# EAGLE schematic BlueESC (EAGLE 7.1.0)
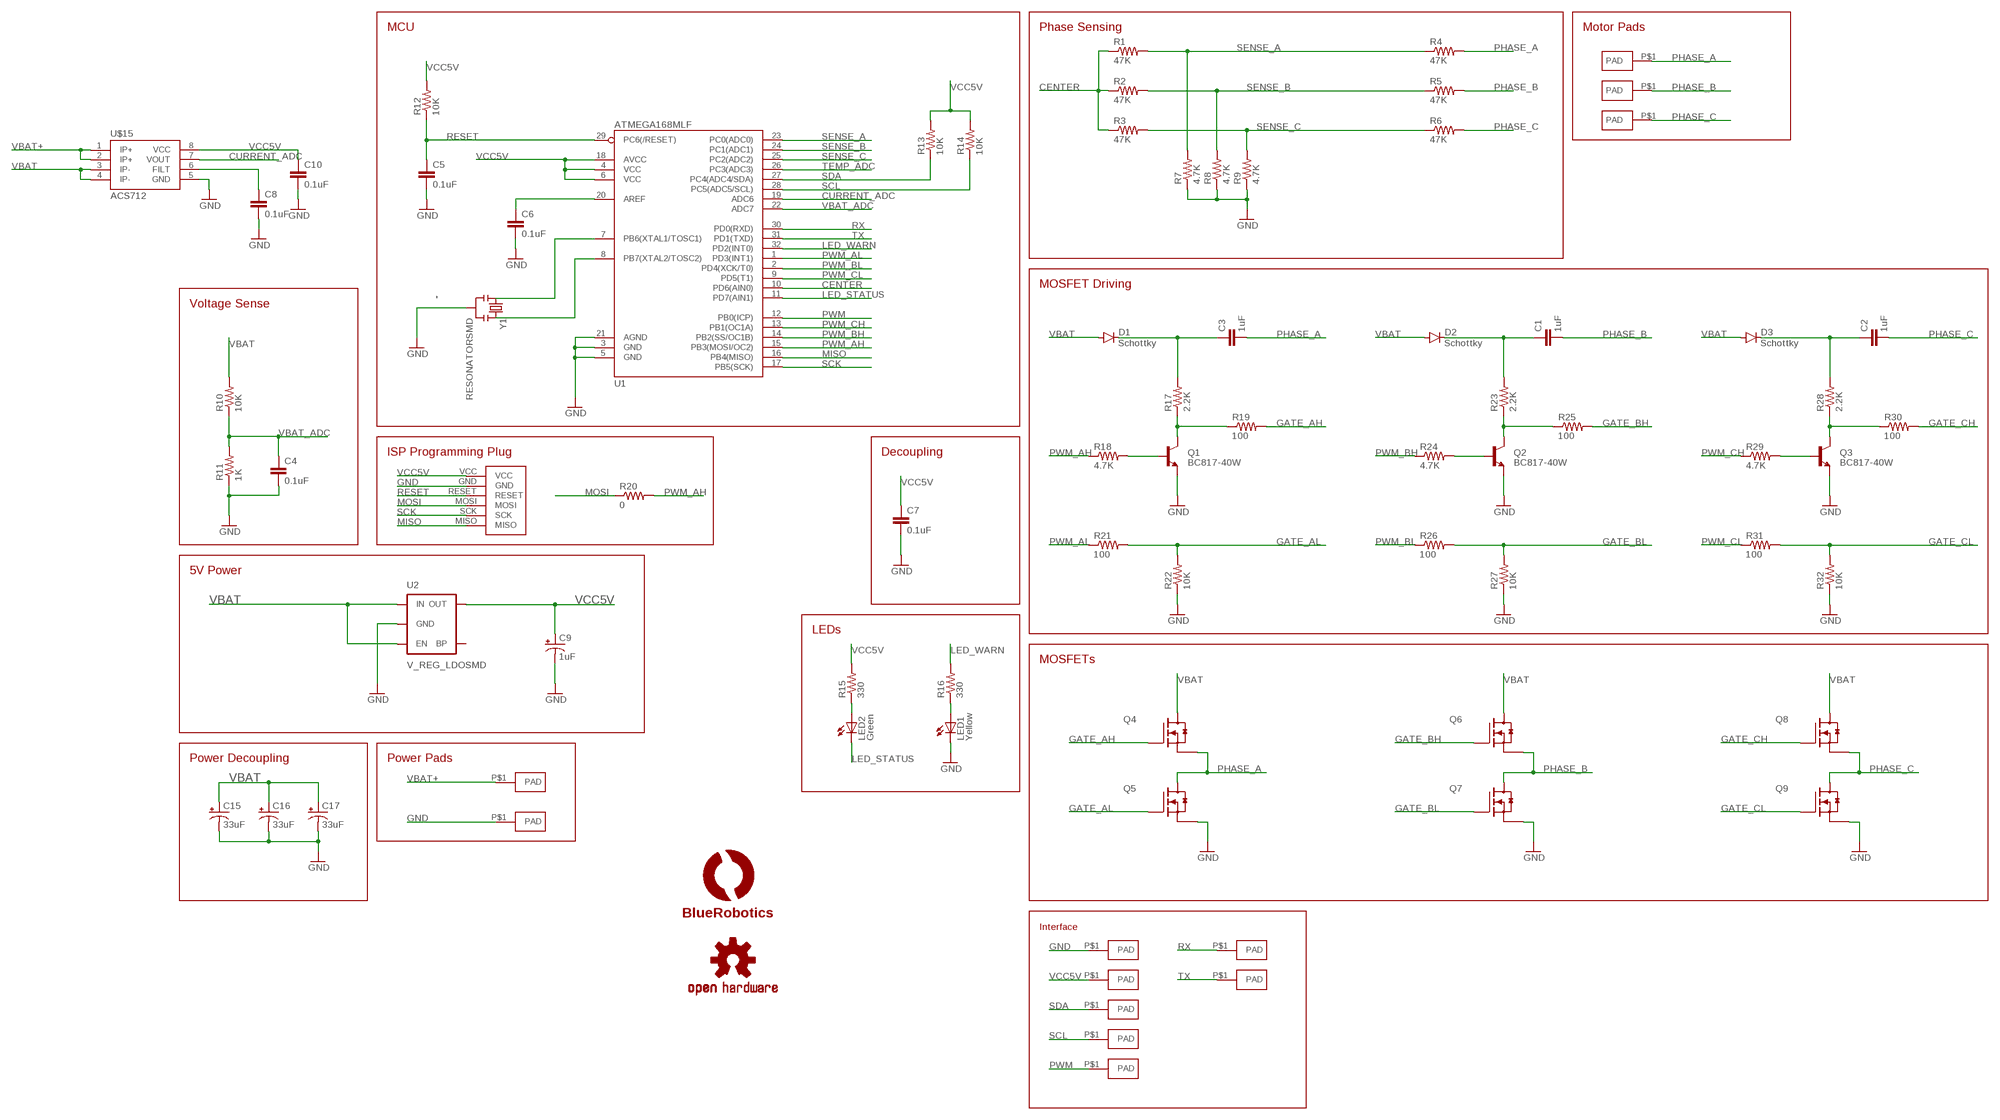
[diagram p0: schematic, sheet 1]

## Parts
C1  1uF  CAP0805  [0805]
C2  1uF  CAP0805  [0805]
C3  1uF  CAP0805  [0805]
C4  0.1uF  CAP0603-CAP  [0603-CAP]
C5  0.1uF  CAP0603-CAP  [0603-CAP]
C6  0.1uF  CAP0603-CAP  [0603-CAP]
C7  0.1uF  CAP0603-CAP  [0603-CAP]
C8  0.1uF  CAP0603-CAP  [0603-CAP]
C9  1uF  CAP_POL1206  [EIA3216]
C10  0.1uF  CAP0603-CAP  [0603-CAP]
C15  33uF  CAP_POL6032  [EIA6032]
C16  33uF  CAP_POL6032  [EIA6032]
C17  33uF  CAP_POL6032  [EIA6032]
D1  Schottky  DIODESOD  [SOD-323]
D2  Schottky  DIODESOD  [SOD-323]
D3  Schottky  DIODESOD  [SOD-323]
LED1  Yellow  LED-3MM-NO_SILK  [LED3MM-NS]
LED2  Green  LED-3MM-NO_SILK  [LED3MM-NS]
LOGO1  OSHW-LOGOS  [OSHW-LOGO-S]
Q1  BC817-40W  TRANSISTOR_NPNSOT23  [SOT23]
Q2  BC817-40W  TRANSISTOR_NPNSOT23  [SOT23]
Q3  BC817-40W  TRANSISTOR_NPNSOT23  [SOT23]
Q4  SI7370  [POWERPAK-SO-08]
Q5  SI7370  [POWERPAK-SO-08]
Q6  SI7370  [POWERPAK-SO-08]
Q7  SI7370  [POWERPAK-SO-08]
Q8  SI7370  [POWERPAK-SO-08]
Q9  SI7370  [POWERPAK-SO-08]
R1  47K  33KOHM1/10W1%(0603)  [0603-RES]
R2  47K  33KOHM1/10W1%(0603)  [0603-RES]
R3  47K  33KOHM1/10W1%(0603)  [0603-RES]
R4  47K  33KOHM1/10W1%(0603)  [0603-RES]
R5  47K  33KOHM1/10W1%(0603)  [0603-RES]
R6  47K  33KOHM1/10W1%(0603)  [0603-RES]
R7  4.7K  RESISTOR0603  [0603-RES]
R8  4.7K  RESISTOR0603  [0603-RES]
R9  4.7K  RESISTOR0603  [0603-RES]
R10  10K  33KOHM1/10W1%(0603)  [0603-RES]
R11  1K  33KOHM1/10W1%(0603)  [0603-RES]
R12  10K  33KOHM1/10W1%(0603)  [0603-RES]
R13  10K  33KOHM1/10W1%(0603)  [0603-RES]
R14  10K  33KOHM1/10W1%(0603)  [0603-RES]
R15  330  RESISTOR0603-RES  [0603-RES]
R16  330  RESISTOR0603-RES  [0603-RES]
R17  2.2K  33KOHM1/10W1%(0603)  [0603-RES]
R18  4.7K  33KOHM1/10W1%(0603)  [0603-RES]
R19  100  33KOHM1/10W1%(0603)  [0603-RES]
R20  0  33KOHM1/10W1%(0603)  [0603-RES]
R21  100  33KOHM1/10W1%(0603)  [0603-RES]
R22  10K  33KOHM1/10W1%(0603)  [0603-RES]
R23  2.2K  33KOHM1/10W1%(0603)  [0603-RES]
R24  4.7K  33KOHM1/10W1%(0603)  [0603-RES]
R25  100  33KOHM1/10W1%(0603)  [0603-RES]
R26  100  33KOHM1/10W1%(0603)  [0603-RES]
R27  10K  33KOHM1/10W1%(0603)  [0603-RES]
R28  2.2K  33KOHM1/10W1%(0603)  [0603-RES]
R29  4.7K  33KOHM1/10W1%(0603)  [0603-RES]
R30  100  33KOHM1/10W1%(0603)  [0603-RES]
R31  100  33KOHM1/10W1%(0603)  [0603-RES]
R32  10K  33KOHM1/10W1%(0603)  [0603-RES]
U1  ATMEGA168MLF  [MLF32]
U2  V_REG_LDOSMD  [SOT23-5]
U$1  PAD2X3MM  [PAD-2X3MM]
U$2  PAD2X3MM  [PAD-2X3MM]
U$3  PAD1.5X3MM  [PAD-1.5X3MM]
U$4  LOGOBR-LOGO-S  [BR-LOGO-SMALL]
U$5  PAD2X3MM  [PAD-2X3MM]
U$6  PAD2X3MM  [PAD-2X3MM]
U$7  PAD2X3MM  [PAD-2X3MM]
U$8  PAD1.5X3MM  [PAD-1.5X3MM]
U$9  PAD1.5X3MM  [PAD-1.5X3MM]
U$10  PAD1.5X3MM  [PAD-1.5X3MM]
U$11  PAD1.5X3MM  [PAD-1.5X3MM]
U$12  PAD1.5X3MM  [PAD-1.5X3MM]
U$13  PAD1.5X3MM  [PAD-1.5X3MM]
U$14  AVR-ISPTINY-SMD  [AVR-ISP-TINY]
U$15  ACS712  [SO08]
Y1  RESONATORSMD  [RESONATOR-SMD]

## Nets
CENTER: R1.1 R2.1 R3.1 U1.10(PD6(AIN0))
CURRENT_ADC: U1.19(ADC6) U$15.7(VOUT)
GATE_AH: Q4.4(G) R19.2
GATE_AL: Q5.4(G) R21.2 R22.2
GATE_BH: Q6.4(G) R25.2
GATE_BL: Q7.4(G) R26.2 R27.2
GATE_CH: Q8.4(G) R30.2
GATE_CL: Q9.4(G) R31.2 R32.2
GND: C4.2 C5.2 C6.2 C7.2 C8.2 C9.C(-) C10.2 C15.P$2(-) C16.P$2(-) C17.P$2(-) LED1.K(C) Q1.2(E) Q2.2(E) Q3.2(E) Q5.3(S3) Q7.3(S3) Q9.3(S3) R7.1 R8.1 R9.1 R11.1 R22.1 R27.1 R32.1 U1.3(GND) U1.5(GND) U1.21(AGND) U2.2(GND) U$2.P$1(PAD) U$3.P$1(PAD) U$14.GND U$15.5(GND) Y1.2
LED_STATUS: LED2.K(C) U1.11(PD7(AIN1))
LED_WARN: R16.2 U1.32(PD2(INT0))
MISO: U1.16(PB4(MISO)) U$14.MISO
MOSI: R20.1 U$14.MOSI
N$1: C8.1 U$15.6(FILT)
N$2: Q1.1(B) R18.2
N$3: LED1.A R16.1
N$4: Q1.3(C) R17.1 R19.1
N$5: Q2.1(B) R24.2
N$6: Q2.3(C) R23.1 R25.1
N$7: Q3.1(B) R29.2
N$8: C6.1 U1.20(AREF)
N$9: Q3.3(C) R28.1 R30.1
N$10: U1.7(PB6(XTAL1/TOSC1)) Y1.1
N$11: U1.8(PB7(XTAL2/TOSC2)) Y1.3
N$12: C3.1 D1.C R17.2
N$15: C1.1 D2.C R23.2
N$16: LED2.A R15.1
N$19: C2.1 D3.C R28.2
PHASE_A: C3.2 Q4.3(S3) Q5.5-8(D) R4.2 U$5.P$1(PAD)
PHASE_B: C1.2 Q6.3(S3) Q7.5-8(D) R5.2 U$6.P$1(PAD)
PHASE_C: C2.2 Q8.3(S3) Q9.5-8(D) R6.2 U$7.P$1(PAD)
PWM: U1.12(PB0(ICP)) U$11.P$1(PAD)
PWM_AH: R18.1 R20.2 U1.15(PB3(MOSI/OC2))
PWM_AL: R21.1 U1.1(PD3(INT1))
PWM_BH: R24.1 U1.14(PB2(SS/OC1B))
PWM_BL: R26.1 U1.2(PD4(XCK/T0))
PWM_CH: R29.1 U1.13(PB1(OC1A))
PWM_CL: R31.1 U1.9(PD5(T1))
RESET: C5.1 R12.1 U1.29(PC6(/RESET)) U$14.RESET
RX: U1.30(PD0(RXD)) U$12.P$1(PAD)
SCK: U1.17(PB5(SCK)) U$14.SCK
SCL: R14.1 U1.28(PC5(ADC5/SCL)) U$10.P$1(PAD)
SDA: R13.1 U1.27(PC4(ADC4/SDA)) U$9.P$1(PAD)
SENSE_A: R1.2 R4.1 R7.2 U1.23(PC0(ADC0))
SENSE_B: R2.2 R5.1 R8.2 U1.24(PC1(ADC1))
SENSE_C: R3.2 R6.1 R9.2 U1.25(PC2(ADC2))
TEMP_ADC: U1.26(PC3(ADC3))
TX: U1.31(PD1(TXD)) U$13.P$1(PAD)
VBAT: C15.P$1(+) C16.P$1(+) C17.P$1(+) D1.A D2.A D3.A Q4.5-8(D) Q6.5-8(D) Q8.5-8(D) R10.2 U2.1(IN) U2.3(EN) U$15.3(IP-) U$15.4(IP-)
VBAT+: U$1.P$1(PAD) U$15.1(IP+) U$15.2(IP+)
VBAT_ADC: C4.1 R10.1 R11.2 U1.22(ADC7)
VCC5V: C7.1 C9.A(+) C10.1 R12.2 R13.2 R14.2 R15.2 U1.4(VCC) U1.6(VCC) U1.18(AVCC) U2.5(OUT) U$8.P$1(PAD) U$14.VCC U$15.8(VCC)
Unconnected: Q4.1(S1) Q4.2(S2) Q5.1(S1) Q5.2(S2) Q6.1(S1) Q6.2(S2) Q7.1(S1) Q7.2(S2) Q8.1(S1) Q8.2(S2) Q9.1(S1) Q9.2(S2) U2.4(BP)

## Notes on the sheet
- MCU | Phase Sensing | Motor Pads
- MOSFET Driving
- Voltage Sense
- ISP Programming Plug | Decoupling
- 5V Power
- LEDs
- MOSFETs
- Power Decoupling | Power Pads
- Interface

## Library data of the parts
C1-C8 C10 = SparkFun-Capacitors:CAP: Capacitor Standard 0603 ceramic capacitor, and 0.1" leaded capacitor.
C9 C15-C17 = SparkFun-Capacitors:CAP_POL: Capacitor Polarized These are standard SMD and PTH capacitors. Normally 10uF, 47uF, and 100uF in electrolytic and tantalum varieties. Always verify the external diameter of the through hole cap, it varies with capacity, voltage, and manufacturer. The EIA devices should be standard.
D1-D3 = SparkFun-DiscreteSemi:DIODE: Diode These are standard reverse protection diodes and small signal diodes. SMA package can handle up to about 1A. SOD-323 can handle about 200mA. What the SOD-323 package when ordering, there are some mfgs out there that are 5-pin packages.; PROD_ID: DIO-09646
LED1 LED2 = SparkFun:LED: LEDs Standard schematic elements and footprints for 5mm, 3mm, 1206, and 0603 sized LEDs. 5mm - Spark Fun Electronics SKU : COM-00529 (and others)
LOGO1 = SparkFun-Aesthetics:OSHW-LOGO: Open Source Hardware Logo This logo indicates the piece of hardware it is found on incorporates a OSHW license and/or adheres to the definition of open source hardware found here: http://freedomdefined.org/OSHW
Q1-Q3 = SparkFun-DiscreteSemi:TRANSISTOR_NPN: Generic NPN BJT MMBT2222A - TRANS-08049 (SOT-23, 1A 40V) MPSA42 - TRANS-09116 (SOT-23, 500mA 300V) MMBT5088LT1G - TRANS-11160 (SOT-23, 50 mA 30V) BC547 - COM-08928 <http://www.sparkfun.com/products/8928> (TO-92 45V 100mA) (1.Collector 2.Base 3.Emitter) 2N3904 - COM-00521 <http://www.sparkfun.com/products/521> (TO-92 40V 200mA) (1.Emitter 2.Base 3.Collector) P2N2222A - COM-12852 <http://www.sparkfun.com/products/12852> (TO-92 40V 600mA) (1.Collector 2.Base 3.Emitter)
Q4-Q9 = transistor-fet-bobstarr:SI7370: N-Channel MOSFET - 60v
R1-R6 R10-R14 R17-R32 = SparkFun-Resistors:33KOHM1/10W1%(0603): RES-08416
R7-R9 = SparkFun-Resistors:RESISTOR: Resistor Basic schematic elements and footprints for 0603, 1206, and PTH resistors.
R15 R16 = SparkFun:RESISTOR: Resistor Basic schematic elements and footprints for 0603, 1206, and PTH resistors.
U1 = SparkFun-DigitalIC:ATMEGA168: Atmel 32-pin 8-bit micro, 16k flash.
U2 = SparkFun-PowerIC:V_REG_LDO: Voltage Regulator LDO Standard 150mA LDO voltage regulator in SOT-23 layout. Micrel part MIC5205. BP (by-pass) pin is used to lower output noise with 470pF cap.
U$1-U$3 U$5-U$13 = BR-Eagle-Library:PAD
U$4 = BR-Eagle-Library:LOGO
U$14 = BR-Eagle-Library:AVR-ISP
U$15 = SparkFun-AnalogIC:ACS712: Hall-effect-based isolated linear current sensor
Y1 = SparkFun:RESONATOR: Resonator Small SMD resonator. This is the itty bitty 10/20MHz resonators with built in caps. CSTCE10M0G55 and CSTCE20M0V53. Footprint has been reviewed closely but hasn't been tested yet.